# EAGLE design smarty09b (EAGLE 6.5.0)
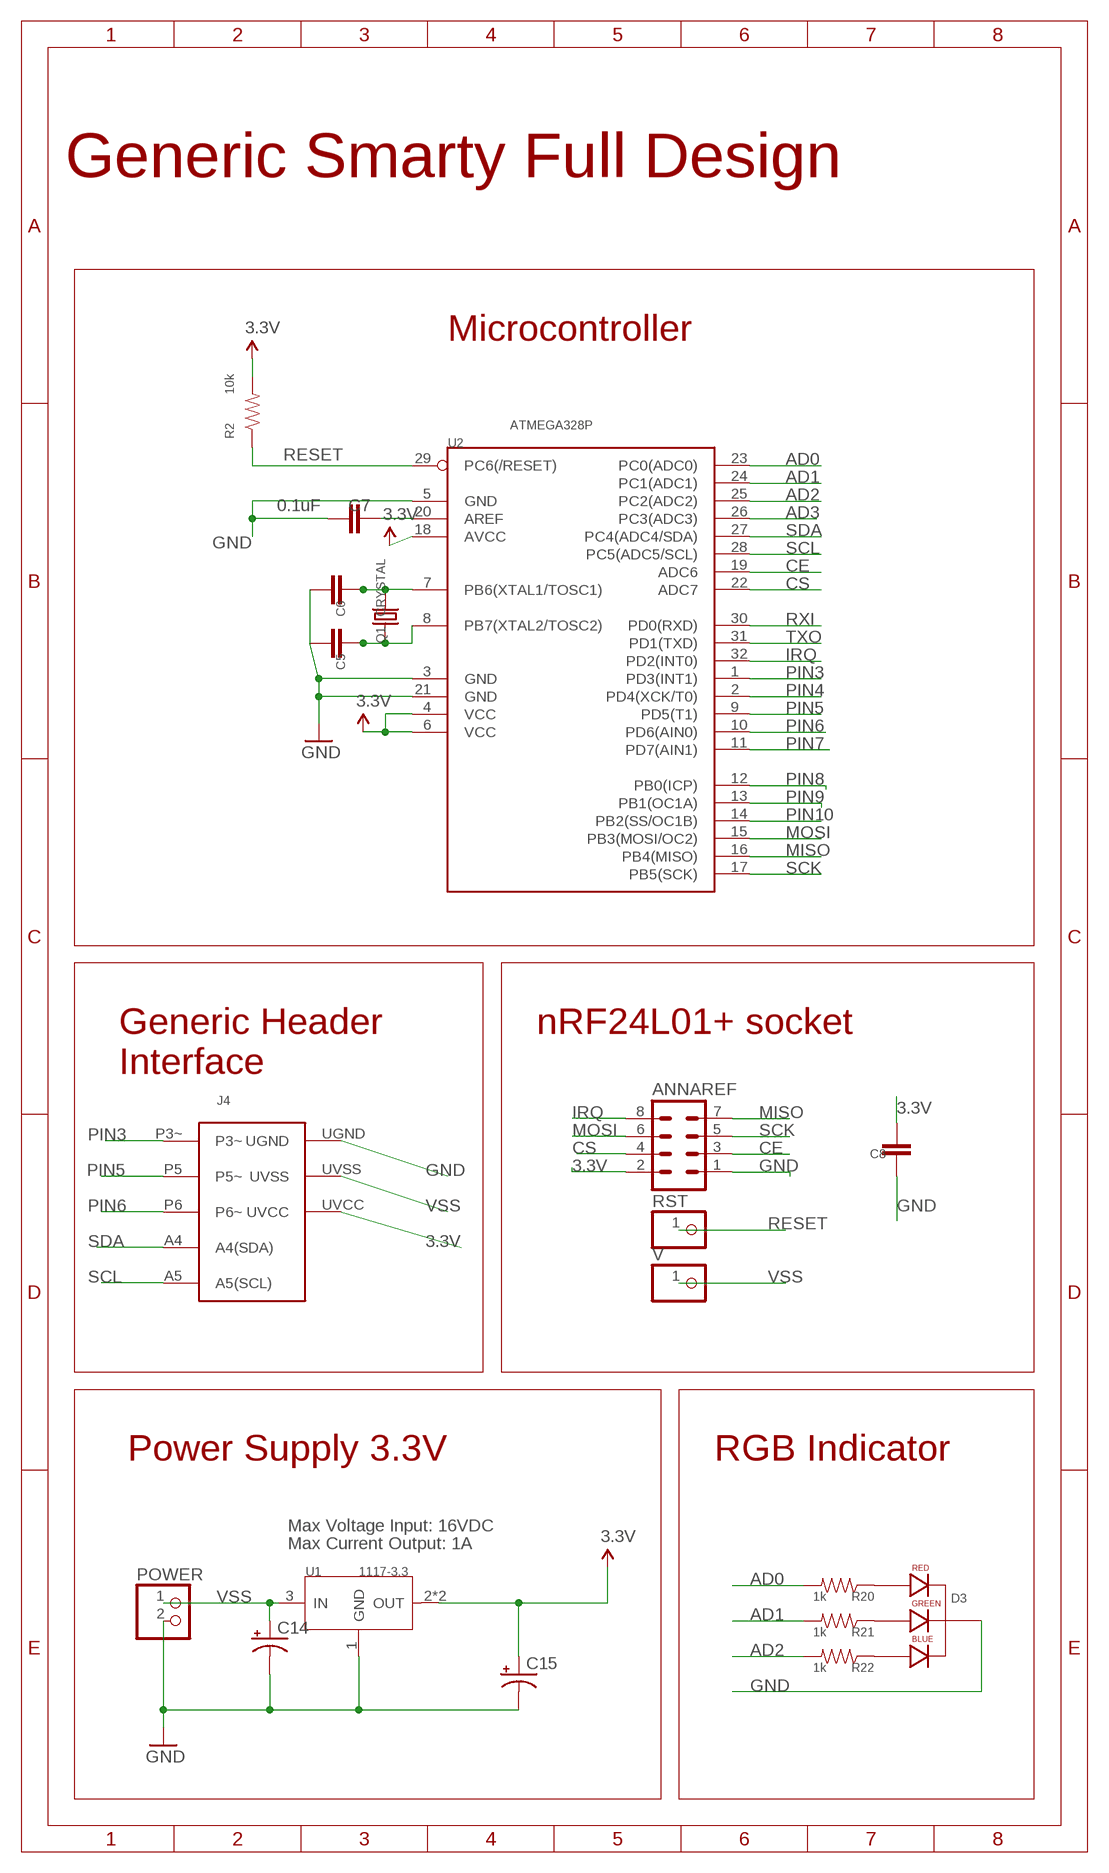
[diagram p0: schematic, sheet 1]

## Parts
ANNAREF  MA04-2  [MA04-2]
C5  CAP1206  [1206]
C6  CAP1206  [1206]
C7  0.1uF  CAP1206  [1206]
C8  CAP1206  [1206]
C14  CAP_POL6032  [EIA6032]
C15  CAP_POL6032  [EIA6032]
D3  LED-RGB-CC-THRUCLEAR  [LED-RGB-THRU]
J4  SMARTY-USHIELD  [SMARTY-USHIELD-2.54]
POWER  PINHD-1X2  [1X02]
Q1  CRYSTAL  CRYSTAL-0500290P1  [2P-SMD-5.0X3.2]
R2  10k  RESISTOR1206  [1206]
R20  1k  RESISTOR1206  [1206]
R21  1k  RESISTOR1206  [1206]
R22  1k  RESISTOR1206  [1206]
RST  PINHD-1X1  [1X01]
U1  1117-3.3  CJ1117-3.3-1310120P1  [SOT89]
U2  ATMEGA328P  ATMEGA328P-AU-1030060P1  [TQFP32]
V  PINHD-1X1  [1X01]

## Nets
3.3V [power]: ANNAREF.2 C8.1 C15.P$1(+) J4.UVCC R2.2 U1.2(OUT) U1.4(OUT) U2.4(VCC) U2.6(VCC) U2.18(AVCC)
AD0: R20.2 U2.23(PC0(ADC0))
AD1: R21.2 U2.24(PC1(ADC1))
AD2: R22.2 U2.25(PC2(ADC2))
AD3: U2.26(PC3(ADC3))
CE: ANNAREF.3 U2.19(ADC6)
CS: ANNAREF.4 U2.22(ADC7)
GND [power]: ANNAREF.1 C5.1 C6.1 C7.2 C8.2 C14.P$2(-) C15.P$2(-) D3.2(CATHODE) J4.UGND POWER.2 U1.1(GND) U2.3(GND) U2.5(GND) U2.21(GND)
IRQ: ANNAREF.8 U2.32(PD2(INT0))
MISO: ANNAREF.7 U2.16(PB4(MISO))
MOSI: ANNAREF.6 U2.15(PB3(MOSI/OC2))
N$1: C7.1 U2.20(AREF)
N$2: C6.2 Q1.2 U2.7(PB6(XTAL1/TOSC1))
N$4: C5.2 Q1.1 U2.8(PB7(XTAL2/TOSC2))
N$42: D3.1(RED_CATHODE) R20.1
N$66: D3.3(GREEN_CATHODE) R21.1
N$67: D3.4(BLUE_CATHODE) R22.1
PIN3: J4.P3~ U2.1(PD3(INT1))
PIN4: U2.2(PD4(XCK/T0))
PIN5: J4.P5(P5~) U2.9(PD5(T1))
PIN6: J4.P6(P6~) U2.10(PD6(AIN0))
PIN7: U2.11(PD7(AIN1))
PIN8: U2.12(PB0(ICP))
PIN9: U2.13(PB1(OC1A))
PIN10: U2.14(PB2(SS/OC1B))
RESET: R2.1 RST.1 U2.29(PC6(/RESET))
RXI: U2.30(PD0(RXD))
SCK: ANNAREF.5 U2.17(PB5(SCK))
SCL: J4.A5(A5(SCL)) U2.28(PC5(ADC5/SCL))
SDA: J4.A4(A4(SDA)) U2.27(PC4(ADC4/SDA))
TXO: U2.31(PD1(TXD))
VSS [power]: C14.P$1(+) J4.UVSS POWER.1 U1.3(IN) V.1

## Notes on the sheet
- Generic Smarty Full Design
- Microcontroller
- nRF24L01+ socket
- Generic Header
  Interface
- Power Supply 3.3V | RGB Indicator
- Max Voltage Input: 16VDC
- Max Current Output: 1A

## Library data of the parts
ANNAREF = con-lstb:MA04-2: PIN HEADER; OC_FARNELL: unknown; OC_NEWARK: unknown
C5-C8 = SparkFun-Passives:CAP: Capacitor Standard 0603 ceramic capacitor, and 0.1" leaded capacitor.
C14 C15 = SparkFun-Passives:CAP_POL: Capacitor Polarized These are standard SMD and PTH capacitors. Normally 10uF, 47uF, and 100uF in electrolytic and tantalum varieties. Always verify the external diameter of the through hole cap, it varies with capacity, voltage, and manufacturer. The EIA devices should be standard.
D3 = smarties:LED-RGB-CC-THRU: RGB Through-hole common cathode LED SparkFun Storefront: COM-00105 (Clear) COM-09264 (Diffuse); PROD_ID: DIO-08418
J4 = smarties:SMARTY-USHIELD: Smarty uShield Header (0.1") This is a pin header with 0.1" (2.54 mm) standard pin steps for Smarty micro-shields. Design : David Lyszyk
POWER = pinhead:PINHD-1X2: PIN HEADER
Q1 = OPL:CRYSTAL*
R2 R20-R22 = SparkFun-Passives:RESISTOR: Resistor Basic schematic elements and footprints for 0603, 1206, and PTH resistors.
RST V = pinhead:PINHD-1X1: PIN HEADER
U1 = OPL:CJ1117-3.3: 1A Low Dropout Linear Regulator
U2 = OPL:ATMEGA328P-AU: 8-bit AVR Microcontroller with 32K Bytes In-System Programmable Flash

## Net classes
0 default: width 0.203 mm, drill 0.203 mm, clearance 0.152 mm
1 power: width 0.254 mm, drill 0.406 mm, clearance 0.152 mm
2 thnet: width 0.203 mm, drill 0.203 mm, clearance 0.305 mm

## Board
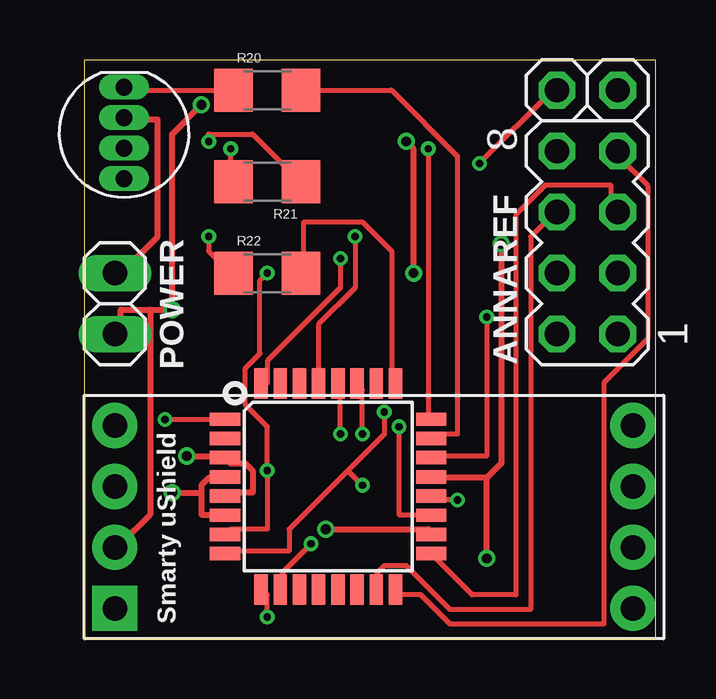
[diagram p1: board, top side]
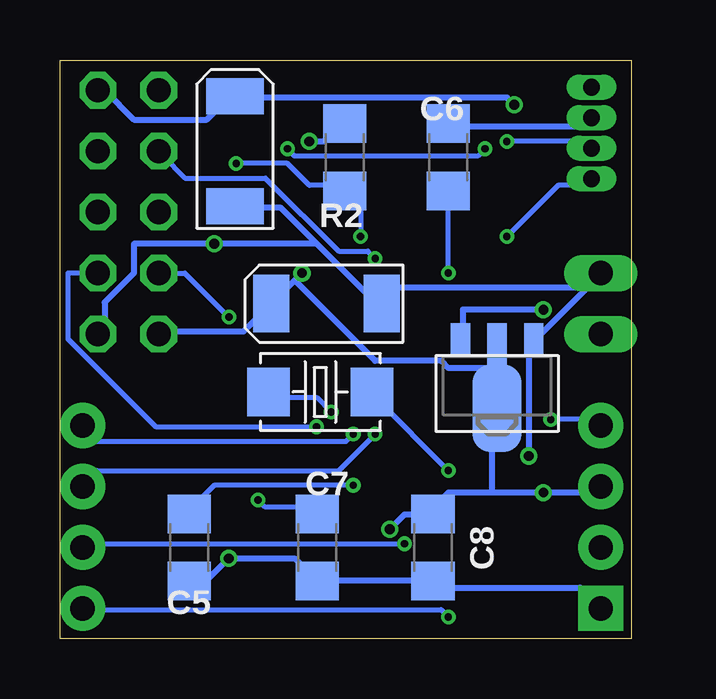
[diagram p2: board, bottom side, seen from below]

Size 23.8 x 24.12 mm. Coordinates in mm from the lower left corner, seen from the top.
Outline: 0,0 23.8,0 23.8,24.12 0,24.12 0,0
Copper layers (1*2*15*16): Top 0.035mm / dielectric 0.2mm / layer 2 0.0175mm / dielectric 1.1mm / layer 15 0.0175mm / dielectric 0.2mm / Bottom 0.035mm
Design rules "SeeedStudio_DRU_no_angle_20130527": minimum track width 6mil, minimum drill 12mil, track to track 6mil, track to pad 6mil, pad to pad 6mil, via to via 6mil, smd to smd 0mil, copper to edge 10mil, drill to drill 10mil, minimum pad ring 6mil, minimum via ring 6mil, stop-mask expansion 2mil, vias tented up to drill 25mil, thermal gap 10mil

### Footprints (pad centres in the part's own frame; a part is rotated, then mirrored left to right if it is on the bottom)
MA04-2 = drill 1.016 octagon: 1 -3.81,-1.27; 2 -3.81,1.27; 3 -1.27,-1.27; 4 -1.27,1.27; 5 1.27,-1.27; 6 1.27,1.27; 7 3.81,-1.27; 8 3.81,1.27
1206 = smd 1.6 x 1.8: 1 -1.4,0; 2 1.4,0
EIA6032 = smd 1.5 x 2.4: P$1 -2.3,0; P$2 2.3,0
LED-RGB-THRU = drill 0.7 pad 1.016 long: 1 1.905,0; 2 0.635,0; 3 -0.635,0; 4 -1.905,0
SMARTY-USHIELD-2.54 = drill 1.016 pad 1.88: A4 3.81,-11.43; A5 1.27,-11.43; P3~ 3.81,10.16; P5 -3.81,-11.43; P6 -1.27,-11.43; UVCC 1.27,10.16; UVSS -1.27,10.16 | drill 1.016 pad 1.88 square: UGND -3.81,10.16
1X02 = drill 1.016 long: 1 -1.27,0; 2 1.27,0
2P-SMD-5.0X3.2 = smd 1.778 x 2.032: 1 -2.159,0; 2 2.159,0
1X01 = drill 1.016 octagon: 1 0,0
SOT89 = smd 0.8 x 1.4: 1 -1.524,-1.905; 3 1.524,-1.905 | smd 0.8 x 1.9: 2 0,-1.651 | smd 2.032 x 3.65: 4 0,0.94
TQFP32 = smd 1.27 x 0.559: 1 -4.293,2.8; 2 -4.293,2; 3 -4.293,1.2; 4 -4.293,0.4; 5 -4.293,-0.4; 6 -4.293,-1.2; 7 -4.293,-2; 8 -4.293,-2.8; 17 4.293,-2.8; 18 4.293,-2; 19 4.293,-1.2; 20 4.293,-0.4; 21 4.293,0.4; 22 4.293,1.2; 23 4.293,2; 24 4.293,2.8 | smd 0.559 x 1.27: 9 -2.8,-4.293; 10 -2,-4.293; 11 -1.2,-4.293; 12 -0.4,-4.293; 13 0.4,-4.293; 14 1.2,-4.293; 15 2,-4.293; 16 2.8,-4.293; 25 2.8,4.293; 26 2,4.293; 27 1.2,4.293; 28 0.4,4.293; 29 -0.4,4.293; 30 -1.2,4.293; 31 -2,4.293; 32 -2.8,4.293

### Placement (x,y rotation side)
ANNAREF  20.95,16.51 90 top
C5  18.41,3.81 90 bottom
C6  7.62,20.07 270 bottom
C7  13.08,3.81 270 bottom
C8  8.26,3.81 270 bottom
C14  16.51,20.32 270 bottom
C15  12.7,13.97 0 bottom
D3  1.65,21.08 90 top
J4  11.43,5.08 90 top
POWER  1.27,13.97 90 top
Q1  12.95,10.29 0 bottom
R2  11.94,20.07 90 bottom
R20  7.62,22.86 0 top
R21  7.62,19.05 180 top
R22  7.62,15.24 0 top
RST  19.68,22.86 0 top
U1  5.59,10.54 180 bottom
U2  10.16,6.35 0 top
V  22.23,22.86 0 top

### Tracks (layer width: path | path; a pad name or v marks a point on that pad's centre or on a via)
3.3V  (via drill 0.41)
  Top 0.254: v13.41,20.73 13.72,20.42 v13.72,15.24 | v10.06,4.57 14.33,4.57 U2.18 | 4.88,6.1 4.88,6.4 5.18,6.71 5.79,6.71 U2.4 | 4.88,6.1 4.88,5.18 5.79,5.18 U2.6 | v3.66,6.1 4.88,6.1
  Bottom 0.254: v13.41,20.73 12.8,20.73 12.19,21.34 R2.2 | 14.02,14.94 14.94,14.02 C15.P$1 15.24,13.72 16.15,12.8 19.51,12.8 ANNAREF.2 | 14.02,14.94 v13.72,15.24 | 5.79,11.28 5.79,9.75 U1.4 5.79,9.45 5.79,6.1 | 5.79,11.28 5.79,12.19 U1.2 5.79,11.28 | v10.06,4.57 9.45,5.18 8.53,5.18 C8.1 8.23,5.49 7.62,6.1 5.79,6.1 | J4.UVCC 1.52,6.1 v3.66,6.1 5.79,6.1 | 14.02,14.94 10.67,11.58 7.92,11.58 7.62,11.28 5.79,11.28
AD0
  Top 0.203: R20.2 12.8,22.86 15.54,20.12 15.54,8.53 14.63,8.53 U2.23
AD1  (via drill 0.3)
  Top 0.203: v14.33,20.42 14.33,9.14 U2.24 | v6.1,20.42 6.1,19.2 R21.2
  Bottom 0.203: v14.33,20.42 14.02,20.12 6.4,20.12 v6.1,20.42
AD2
  Top 0.203: U2.25 12.8,10.67 12.8,16.15 11.58,17.37 9.14,17.37 9.14,15.24 R22.2
CE  (via drill 0.3)
  Top 0.203: v13.11,8.84 13.11,5.18 14.33,5.18 U2.19
  Bottom 0.203: v13.11,8.84 19.81,8.84 23.47,12.5 23.47,15.24 ANNAREF.3
CS  (via drill 0.3)
  Top 0.203: v16.76,13.41 16.76,7.62 14.63,7.62 U2.22
  Bottom 0.203: v16.76,13.41 18.59,15.24 ANNAREF.4
GND  (via drill 0.41)
  Top 0.254: 1.52,1.22 J4.UGND | 16.76,6.71 14.63,6.71 U2.21 | v16.76,3.35 16.76,6.71 | U2.5 6.1,6.1 7.01,6.1 7.01,7.01 6.71,7.32 6.1,7.32 U2.3 5.79,7.62 v4.27,7.62 | D3.2 1.83,21.64 3.05,21.64 3.05,16.76 1.52,15.24 POWER.2 | 16.76,6.71 17.37,7.32 v17.37,16.46
  Bottom 0.254: C5.1 18.29,2.44 17.68,2.44 v16.76,3.35 14.02,3.35 13.11,2.44 C7.2 12.8,2.44 8.53,2.44 C8.2 8.23,2.13 2.13,2.13 J4.UGND | 13.11,16.46 14.63,17.98 16.46,17.98 C14.P$2 | 13.11,16.46 10.67,14.02 C15.P$2 10.36,14.02 9.75,14.63 1.83,14.63 | 13.11,16.46 v17.37,16.46 20.73,16.46 20.73,15.24 21.95,14.02 21.95,12.8 ANNAREF.1 | C6.1 7.62,21.34 2.13,21.34 1.83,21.64 D3.2 | 1.83,14.63 1.22,15.24 POWER.2 1.83,14.63 | 1.83,14.63 3.96,12.5 U1.1 4.27,12.19 v4.27,7.62
IRQ  (via drill 0.3)
  Top 0.203: v10.67,15.85 10.67,14.63 7.62,11.58 7.62,10.67 U2.32
  Bottom 0.203: v10.67,15.85 10.97,16.15 12.19,16.15 15.24,19.2 18.59,19.2 19.51,20.12 ANNAREF.8
MISO
  Top 0.203: U2.16 13.11,1.83 14.02,1.83 15.24,0.61 21.64,0.61 21.64,10.67 23.47,12.5 23.47,18.9 22.25,20.12 ANNAREF.7
MOSI
  Top 0.203: U2.15 12.19,2.13 12.19,2.74 12.5,3.05 13.41,3.05 15.24,1.22 18.59,1.22 18.59,16.76 19.51,17.68 ANNAREF.6
N$1  (via drill 0.3)
  Top 0.203: v15.54,5.79 14.63,5.79 U2.20
  Bottom 0.203: v15.54,5.79 15.24,5.49 13.11,5.49 C7.1
N$2  (via drill 0.3)
  Top 0.203: U2.7 6.1,4.57 7.62,4.57 v7.62,7.01 7.62,8.84 6.71,9.75 6.71,11.28 7.32,11.89 7.32,14.94 v7.62,15.24
  Bottom 0.203: 7.62,18.9 C6.2 v7.62,15.24 | v7.62,7.01 10.67,10.06 Q1.2
N$4  (via drill 0.3)
  Top 0.203: 10.97,7.01 12.5,8.53 v12.5,9.45 | 10.97,7.01 8.53,4.57 8.53,3.66 6.1,3.66 U2.8 | 10.97,7.01 v11.58,6.4
  Bottom 0.203: 18.59,5.18 C5.2 18.29,5.49 17.37,6.4 v11.58,6.4 | v12.5,9.45 13.11,10.06 14.94,10.06 Q1.1
N$42
  Top 0.203: R20.1 1.83,22.86 D3.1
N$66  (via drill 0.3)
  Top 0.203: v5.18,20.73 5.18,21.03 7.01,21.03 8.84,19.2 R21.1
  Bottom 0.203: v5.18,20.73 1.83,20.73 D3.3
N$67  (via drill 0.3)
  Top 0.203: v5.18,16.76 5.18,16.15 6.1,15.24 R22.1
  Bottom 0.203: v5.18,16.76 3.05,18.9 1.83,18.9 D3.4
PIN3  (via drill 0.3)
  Top 0.203: v3.35,9.14 5.79,9.14 U2.1
  Bottom 0.203: v3.35,9.14 1.52,9.14 J4.P3~
PIN5  (via drill 0.3)
  Top 0.203: v7.62,0.91 7.62,1.83 U2.9
  Bottom 0.203: v7.62,0.91 7.92,1.22 22.86,1.22 J4.P5
PIN6  (via drill 0.3)
  Top 0.203: v9.45,3.96 8.23,2.74 8.23,2.13 U2.10
  Bottom 0.203: v9.45,3.96 22.86,3.96 J4.P6
RESET  (via drill 0.3)
  Top 0.203: v11.28,16.76 11.28,14.63 9.75,13.11 9.75,10.67 U2.29 | v16.46,19.81 19.51,22.86 RST.1
  Bottom 0.203: v11.28,16.76 11.28,18.59 11.89,18.59 R2.1 12.19,18.9 13.41,18.9 14.33,19.81 v16.46,19.81
SCK
  Top 0.203: U2.17 14.63,3.35 16.15,1.83 17.98,1.83 17.98,17.68 19.2,18.9 21.95,18.9 21.95,17.98 ANNAREF.5
SCL  (via drill 0.3)
  Top 0.203: v10.67,8.53 10.67,10.36 U2.28
  Bottom 0.203: v10.67,8.53 12.19,7.01 22.25,7.01 22.86,6.4 J4.A5
SDA  (via drill 0.3)
  Top 0.203: v11.58,8.53 11.58,10.36 U2.27
  Bottom 0.203: v11.58,8.53 11.89,8.23 22.25,8.23 22.86,8.84 J4.A4
VSS  (via drill 0.41)
  Top 0.254: 2.74,13.72 1.52,13.72 1.52,12.8 POWER.1 | 2.74,13.72 v3.66,13.72 3.66,21.03 v4.88,22.25 | 2.74,13.72 2.74,5.18 1.52,3.96 J4.UVSS
  Bottom 0.254: V.1 21.95,22.86 20.73,21.64 17.68,21.64 16.76,22.55 C14.P$1 16.46,22.55 5.18,22.55 v4.88,22.25 | v3.66,13.72 7.01,13.72 7.01,12.5 U1.3

### Text on the board
tDocu: - | +
bDocu: RoboTal / Generic / Smartie | v1.0